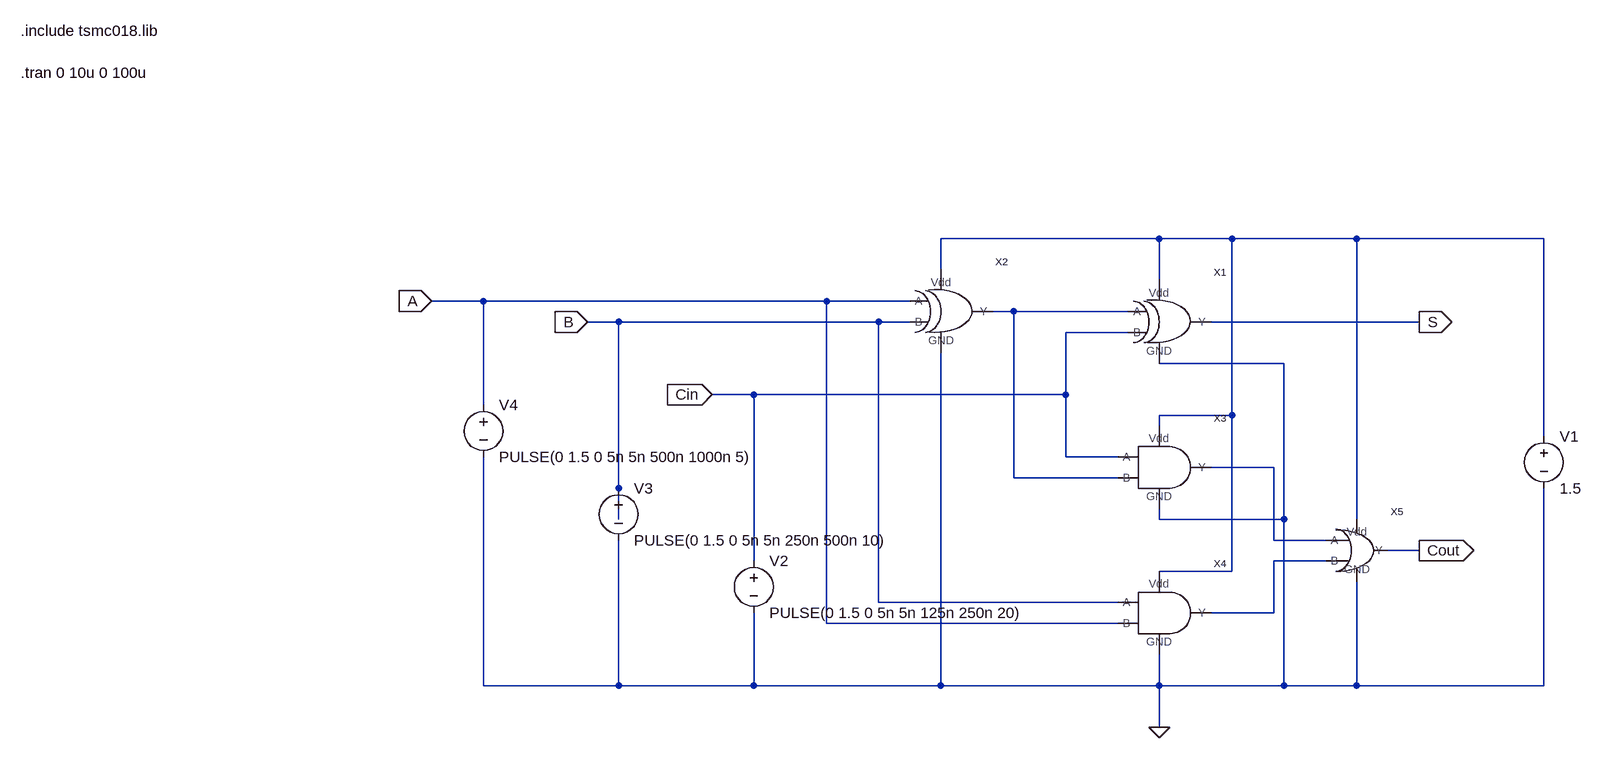
[diagram p0: schematic full_adder.asc]
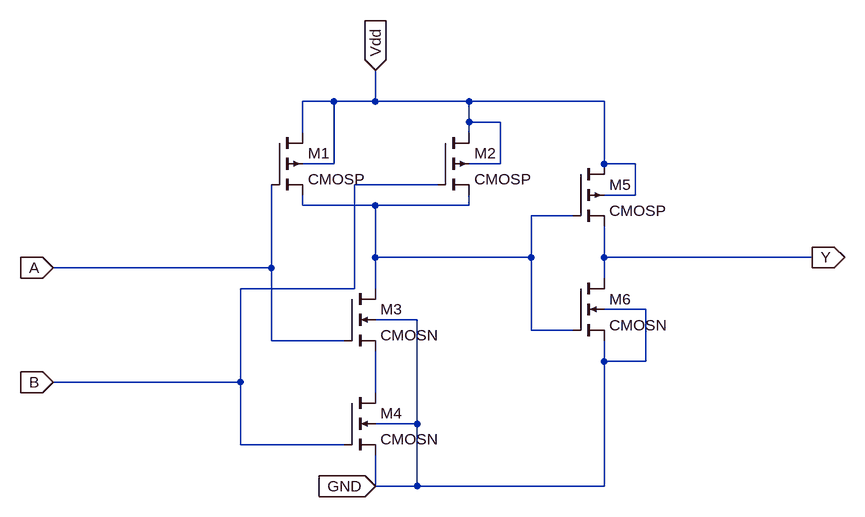
[diagram p1: sub-circuit and_cmos.asc]
full_adder.asc, the LTspice schematic file:
Version 4
SHEET 1 1312 900
WIRE 656 128 320 128
WIRE 768 128 656 128
WIRE 960 128 768 128
WIRE 1248 128 960 128
WIRE 320 176 320 128
WIRE 656 192 656 128
WIRE -384 224 -464 224
WIRE 144 224 -384 224
WIRE 272 224 144 224
WIRE 432 240 400 240
WIRE 608 240 432 240
WIRE -176 256 -224 256
WIRE 224 256 -176 256
WIRE 272 256 224 256
WIRE 1056 256 736 256
WIRE 608 272 512 272
WIRE 848 320 656 320
WIRE 32 368 -32 368
WIRE 512 368 512 272
WIRE 512 368 32 368
WIRE -384 384 -384 224
WIRE 768 400 768 128
WIRE 768 400 656 400
WIRE 656 416 656 400
WIRE 1248 432 1248 128
WIRE 512 464 512 368
WIRE 592 464 512 464
WIRE 832 480 736 480
WIRE 432 496 432 240
WIRE 592 496 432 496
WIRE -176 512 -176 256
WIRE -176 560 -176 512
WIRE 656 560 656 544
WIRE 848 560 848 320
WIRE 848 560 656 560
WIRE 960 560 960 128
WIRE 832 592 832 480
WIRE 912 592 832 592
WIRE 1056 608 1008 608
WIRE 32 624 32 368
WIRE 912 624 832 624
WIRE 768 640 768 400
WIRE 768 640 656 640
WIRE 224 688 224 256
WIRE 592 688 224 688
WIRE 832 704 832 624
WIRE 832 704 736 704
WIRE 144 720 144 224
WIRE 592 720 144 720
WIRE -384 816 -384 464
WIRE -176 816 -176 592
WIRE -176 816 -384 816
WIRE 32 816 32 704
WIRE 32 816 -176 816
WIRE 320 816 320 304
WIRE 320 816 32 816
WIRE 656 816 656 768
WIRE 656 816 320 816
WIRE 848 816 848 560
WIRE 848 816 656 816
WIRE 960 816 960 656
WIRE 960 816 848 816
WIRE 1248 816 1248 512
WIRE 1248 816 960 816
WIRE 656 880 656 816
FLAG 656 880 0
FLAG 1056 256 S
IOPIN 1056 256 Out
FLAG 1056 608 Cout
IOPIN 1056 608 Out
FLAG -464 224 A
IOPIN -464 224 In
FLAG -224 256 B
IOPIN -224 256 In
FLAG -32 368 Cin
IOPIN -32 368 In
SYMBOL xor_cmos 288 208 R0
SYMATTR InstName X2
SYMBOL xor_cmos 624 224 R0
SYMATTR InstName X1
SYMBOL and_cmos 624 448 R0
SYMATTR InstName X3
SYMBOL and_cmos 624 672 R0
SYMATTR InstName X4
SYMBOL or_cmos 928 576 R0
SYMATTR InstName X5
SYMBOL voltage 1248 416 R0
WINDOW 123 0 0 Left 0
WINDOW 39 0 0 Left 0
SYMATTR InstName V1
SYMATTR Value 1.5
SYMBOL voltage 32 608 R0
WINDOW 123 0 0 Left 0
WINDOW 39 0 0 Left 0
SYMATTR InstName V2
SYMATTR Value PULSE(0 1.5 0 5n 5n 125n 250n 20)
SYMBOL voltage -176 496 R0
WINDOW 123 0 0 Left 0
WINDOW 39 0 0 Left 0
SYMATTR InstName V3
SYMATTR Value PULSE(0 1.5 0 5n 5n 250n 500n 10)
SYMBOL voltage -384 368 R0
WINDOW 123 0 0 Left 0
WINDOW 39 0 0 Left 0
SYMATTR InstName V4
SYMATTR Value PULSE(0 1.5 0 5n 5n 500n 1000n 5)
TEXT -1096 -192 Left 2 !.include tsmc018.lib
TEXT -1096 -128 Left 2 !.tran 0 10u 0 100u

and_cmos.asc, the sub-circuit schematic file:
Version 4
SHEET 1 1020 696
WIRE 208 32 160 32
WIRE 272 32 272 -16
WIRE 272 32 208 32
WIRE 416 32 272 32
WIRE 624 32 416 32
WIRE 416 64 416 32
WIRE 464 64 416 64
WIRE 160 80 160 32
WIRE 416 80 416 64
WIRE 208 128 208 32
WIRE 208 128 160 128
WIRE 464 128 464 64
WIRE 464 128 416 128
WIRE 624 128 624 32
WIRE 672 128 624 128
WIRE 368 160 240 160
WIRE 672 176 672 128
WIRE 672 176 624 176
WIRE 160 192 160 176
WIRE 272 192 160 192
WIRE 416 192 416 176
WIRE 416 192 272 192
WIRE 576 208 512 208
WIRE 272 272 272 192
WIRE 512 272 512 208
WIRE 512 272 272 272
WIRE 624 272 624 224
WIRE 944 272 624 272
WIRE 112 288 112 160
WIRE 112 288 -224 288
WIRE 624 304 624 272
WIRE 240 320 240 160
WIRE 240 320 64 320
WIRE 272 320 272 272
WIRE 688 352 624 352
WIRE 336 368 272 368
WIRE 512 384 512 272
WIRE 576 384 512 384
WIRE 112 400 112 288
WIRE 224 400 112 400
WIRE 624 432 624 400
WIRE 688 432 688 352
WIRE 688 432 624 432
WIRE 64 464 64 320
WIRE 64 464 -224 464
WIRE 272 480 272 416
WIRE 336 528 336 368
WIRE 336 528 272 528
WIRE 64 560 64 464
WIRE 224 560 64 560
WIRE 272 624 272 576
WIRE 336 624 336 528
WIRE 336 624 272 624
WIRE 624 624 624 432
WIRE 624 624 336 624
FLAG 272 -16 Vdd
IOPIN 272 -16 In
FLAG 272 624 GND
IOPIN 272 624 In
FLAG -224 288 A
IOPIN -224 288 In
FLAG -224 464 B
IOPIN -224 464 In
FLAG 944 272 Y
IOPIN 944 272 Out
SYMBOL cmosp 112 80 R0
SYMATTR InstName M1
SYMATTR Value2 l=180n w=1u
SYMBOL cmosp 368 80 R0
SYMATTR InstName M2
SYMATTR Value2 l=180n w=1u
SYMBOL cmosn 224 320 R0
SYMATTR InstName M3
SYMATTR Value2 l=180n w=1u
SYMBOL cmosn 224 480 R0
SYMATTR InstName M4
SYMATTR Value2 l=180n w=1u
SYMBOL cmosp 576 128 R0
SYMATTR InstName M5
SYMBOL cmosn 576 304 R0
SYMATTR InstName M6

The netlist it stands for:
* full_adder.asc
XX2 N002 N001 0 A B xor_cmos  ; pins Y Vdd GND A B
XX1 S N001 0 N002 Cin xor_cmos  ; pins Y Vdd GND A B
XX3 N003 N001 0 Cin N002 and_cmos
XX4 N004 N001 0 B A and_cmos
XX5 Cout N001 0 N003 N004 or_cmos  ; pins Y Vdd GND A B
V1 N001 0 1.5
V2 Cin 0 PULSE(0 1.5 0 5n 5n 125n 250n 20)
V3 B 0 PULSE(0 1.5 0 5n 5n 250n 500n 10)
V4 A 0 PULSE(0 1.5 0 5n 5n 500n 1000n 5)

* block symbol definitions
.subckt and_cmos Y Vdd GND A B
M1 Vdd A N001 Vdd CMOSP l=180n w=1u
M2 Vdd B N001 Vdd CMOSP l=180n w=1u
M3 N001 A N002 GND CMOSN l=180n w=1u
M4 N002 B GND GND CMOSN l=180n w=1u
M5 Vdd N001 Y Vdd CMOSP
M6 Y N001 GND GND CMOSN
.ends and_cmos

.model NMOS NMOS
.model PMOS PMOS
.lib standard.mos
.include tsmc018.lib
.tran 0 10u 0 100u
.backanno
.end